# Altium schematic sheet Interface.SchDoc
size A4; SheetNumber: 3; SheetTotal: 6
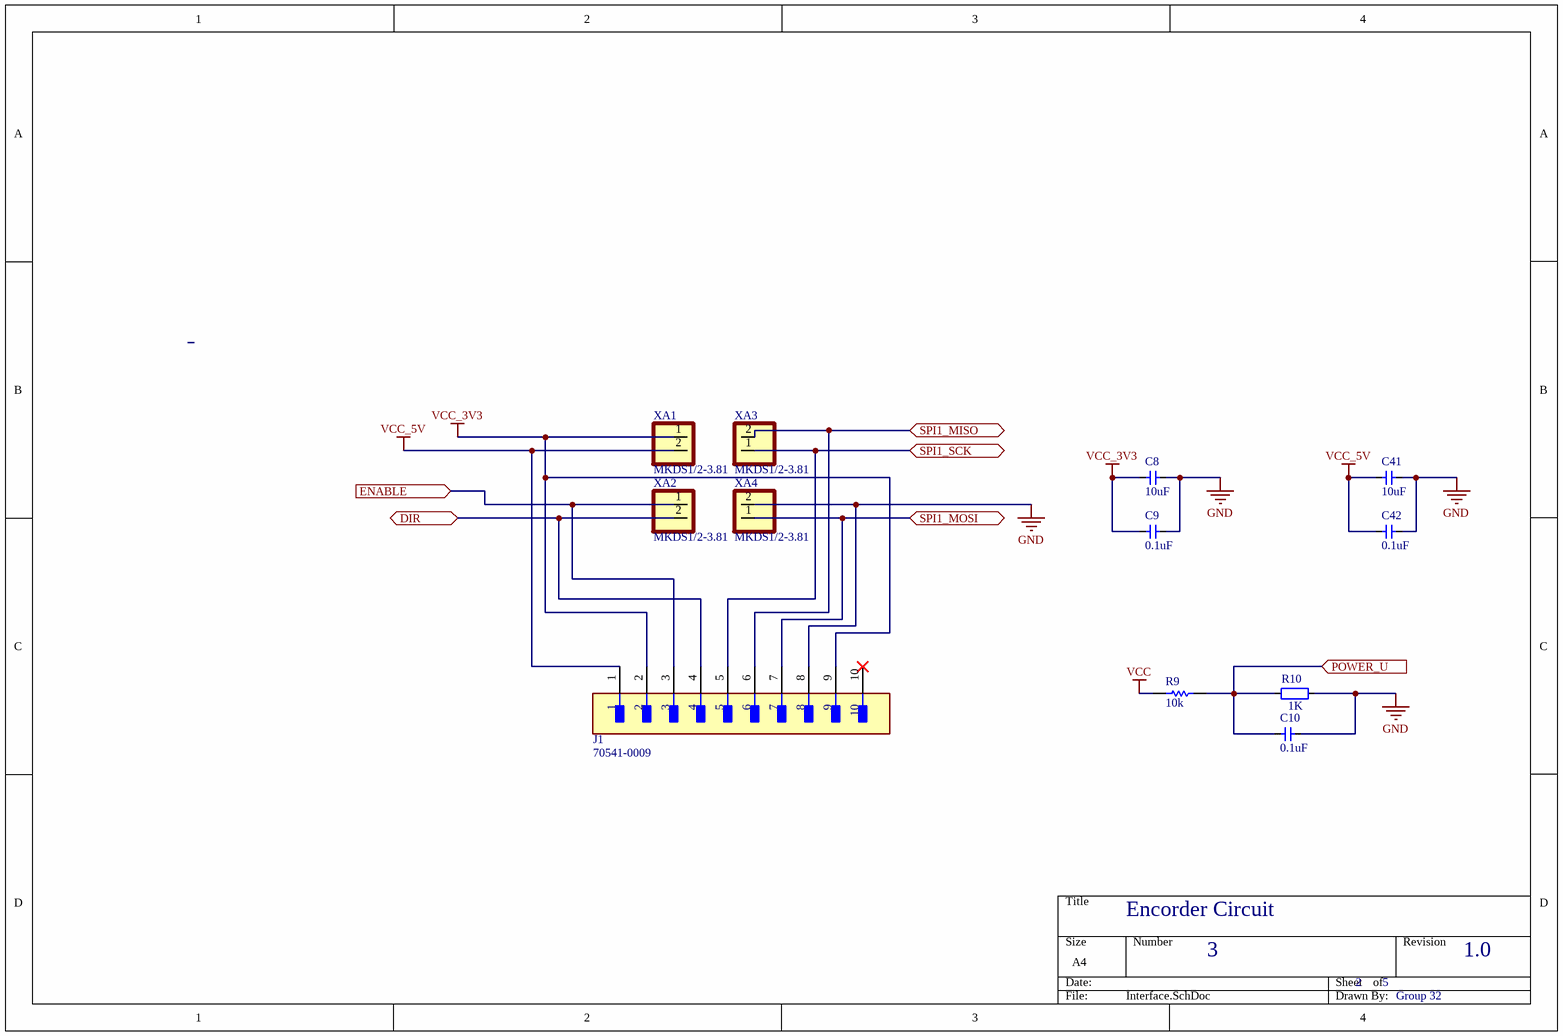
[diagram p0: Interface.SchDoc]

## Parts
C8  10uF  [CAPC2013X94X50LL20T25]
C9  0.1uF  [CAPC2013X94X50LL20T25]
C10  0.1uF  [CAPC2013X94X50LL20T25]
C41  10uF  [CAPC2013X94X50LL20T25]
C42  0.1uF  [CAPC2013X94X50LL20T25]
J1  70541-0009  [FP-70541-0009-MFG]
R9  REs: 10k  [RESC2013X60X35NL10T20]  (hidden comment: RC0805FR-0710KL)
R10  1K  [RESC3116X65N]
XA1  MKDS1/2-3.81  [PHOENIX_MKDS1/2-3.81 - duplicate]
XA2  MKDS1/2-3.81  [PHOENIX_MKDS1/2-3.81 - duplicate]
XA3  MKDS1/2-3.81  [PHOENIX_MKDS1/2-3.81 - duplicate]
XA4  MKDS1/2-3.81  [PHOENIX_MKDS1/2-3.81 - duplicate]

## Ports
DIR (bidir), ENABLE (in), POWER_U (in, see Main[3C], MCU[1A]), SPI1_MISO (bidir, see Main[3B], MCU[3A]), SPI1_MOSI (bidir, see Main[3B], MCU[3B]), SPI1_SCK (bidir, see Main[3B], MCU[3A])

## Nets
GND: C8.1 C9.1 C10.1 C41.1 C42.1 J1.8 R10.2 XA4.2
VCC: R9.1
VCC_3V3: C8.2 C9.2 J1.2 J1.9 XA1.1
VCC_5V: C41.2 C42.2 J1.1 XA1.2
DIR: J1.4 XA2.2 ; port DIR
ENABLE: J1.3 XA2.1 ; port ENABLE
POWER_U: C10.2 R9.2 R10.1 ; port POWER_U
SPI1_MISO: J1.6 XA3.2 ; port SPI1_MISO
SPI1_MOSI: J1.7 XA4.1 ; port SPI1_MOSI
SPI1_SCK: J1.5 XA3.1 ; port SPI1_SCK

Not connected (* = marked no-connect by the designer): J1 10*

## Notes on the sheet
- Encorder Circuit
- 3
- 2
- 5
- 1.0
- Group 32

## Library data of the parts
C8-C10 C41 C42 = 电容-0402: Capacitor; Value: 0.1u
J1 = CMP-04776-001054-1: CONN HEADER VERT 10POS 2.54MM; Current Rating: 3A; Number of Positions: 10; Contact Post Length: 3.3mm; Voltage Rating: 250V; Contact Resistance: 15mR; Glow Wire Compliant: Non-compliant; Series: 70541; Pitch: 2.54mm; Orientation: Vertical; Contact Material: Bronze; Number of Rows: 1; Min Operating Temperature: -40°C; Flammability Rating: UL94 V-0; Number of Contacts: 10; Packaging: Rail/Tube; Contact Plating: Tin; Number of Circuits: 10; Housing Material: Polyester; Termination: Through Hole; Material: Brass; Max Operating Temperature: 105°C; Package Quantity: 768; Mount: Through Hole; Contact Mating Length: 6.1mm; ELV: Compliant; Contact Gender: Male
R9 = CMP-1659-00013-4: Chip Resistor, 10 KOhm, +/- 1%, 0.125 W, -55 to 155 degC, 0805 (2012 Metric), RoHS, Tape and Reel; Manufacturer: Yageo; Voltage Rating: 150 V; Mount: Surface Mount; ComponentLink1Description: Manufacturer URL; ComponentLink2URL: http://www.yageo.com/documents/recent/PYu-RC_Group_51_RoHS_L_04.pdf; Pins: 2; Length: 2 mm; Min Operating Temperature: -55 degC; Height: 0.5 mm; Mounting Technology: Surface Mount; RoHSCompliant: true; REACH SVHC: No SVHC; ComponentLink1URL: http://www.yageo.com/; Max Operating Temperature: 155 degC; PackageReference: 0805; DatasheetVersion: Rev. 4, 02/2016; Package Quantity: 5000; Packaging: Tape and Reel; ComponentLink2Description: Datasheet; PackageDescription: 2-Pin Surface Mounted Device, Body 2 x 1.25 mm
R10 = 电阻-0402: Resistor; Value: 22R
XA1-XA4 = MKDS1/2-3.81: 2 Position Wire to Board Terminal Block Horizontal with Board 0.150 _3.81mm_ Through Hole; MF: Phoenix Contact; Package: None; Price: None; SnapEDA_Link: https://www.snapeda.com/parts/MKDS%201/%202-3.81/Phoenix%20Contact/view-part/114562/?ref=snap; Availability: Unavailable; Value: *; MP: MKDS 1/ 2-3.81